# Altium schematic sheet Conn6&5.SchDoc
size A
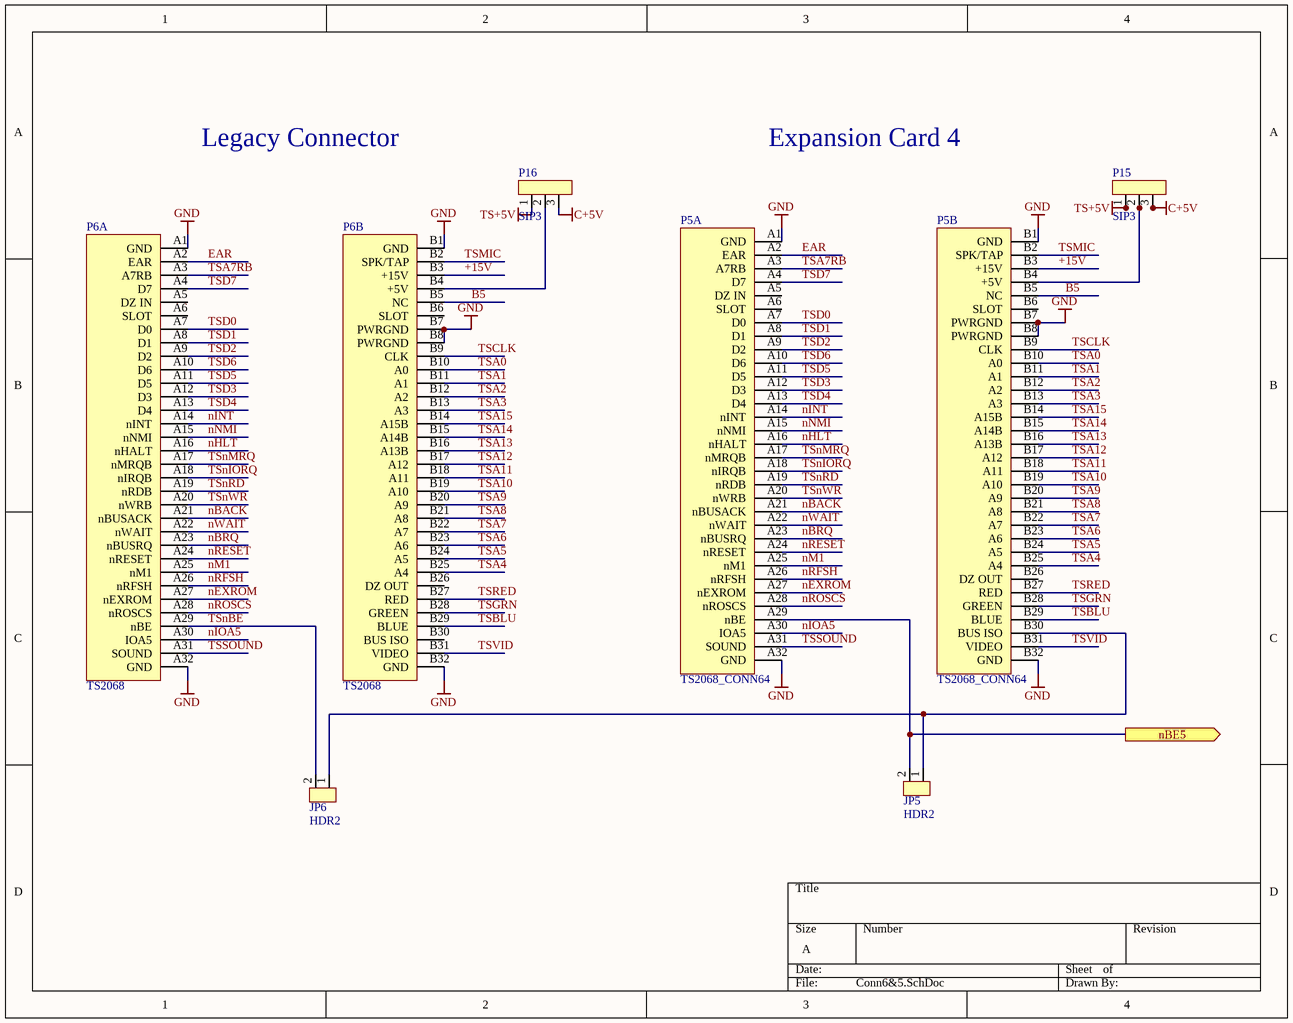
[diagram p0: Conn6&5.SchDoc]

## Parts
JP5  HDR2  [HDR2]
JP6  HDR2  [HDR2]
P5  TS2068_CONN64  [64CARDEDGE]  (parts A,B of 2)
P6  TS2068  [TS2068]  (parts A,B of 2)
P15  SIP3  [SIP3]
P16  SIP3  [SIP3]

## Ports
nBE5 (out)

## Nets
C+5V: P15.3 P16.3
GND: P5.A1(GND) P5.A32(GND) P5.B1(GND) P5.B7(PWRGND) P5.B8(PWRGND) P5.B32(GND) P6.A1(GND) P6.A32(GND) P6.B1(GND) P6.B7(PWRGND) P6.B8(PWRGND) P6.B32(GND)
TS+5V: P15.1 P16.1
+15V: P5.B3(+15V) P6.B3(+15V)
B5: P5.B5(NC) P6.B5(NC)
EAR: P5.A2(EAR) P6.A2(EAR)
nBACK: P5.A21(nBUSACK) P6.A21(nBUSACK)
nBE5: JP5.2 P5.A29(nBE) ; port nBE5
nBRQ: P5.A23(nBUSRQ) P6.A23(nBUSRQ)
nEXROM: P5.A27(nEXROM) P6.A27(nEXROM)
nHLT: P5.A16(nHALT) P6.A16(nHALT)
nINT: P5.A14(nINT) P6.A14(nINT)
nIOA5: P5.A30(IOA5) P6.A30(IOA5)
nM1: P5.A25(nM1) P6.A25(nM1)
nNMI: P5.A15(nNMI) P6.A15(nNMI)
nRESET: P5.A24(nRESET) P6.A24(nRESET)
nRFSH: P5.A26(nRFSH) P6.A26(nRFSH)
nROSCS: P5.A28(nROSCS) P6.A28(nROSCS)
nWAIT: P5.A22(nWAIT) P6.A22(nWAIT)
TSA0: P5.B10(A0) P6.B10(A0)
TSA1: P5.B11(A1) P6.B11(A1)
TSA2: P5.B12(A2) P6.B12(A2)
TSA3: P5.B13(A3) P6.B13(A3)
TSA4: P5.B25(A4) P6.B25(A4)
TSA5: P5.B24(A5) P6.B24(A5)
TSA6: P5.B23(A6) P6.B23(A6)
TSA7: P5.B22(A7) P6.B22(A7)
TSA7RB: P5.A3(A7RB) P6.A3(A7RB)
TSA8: P5.B21(A8) P6.B21(A8)
TSA9: P5.B20(A9) P6.B20(A9)
TSA10: P5.B19(A10) P6.B19(A10)
TSA11: P5.B18(A11) P6.B18(A11)
TSA12: P5.B17(A12) P6.B17(A12)
TSA13: P5.B16(A13B) P6.B16(A13B)
TSA14: P5.B15(A14B) P6.B15(A14B)
TSA15: P5.B14(A15B) P6.B14(A15B)
TSBLU: P5.B29(BLUE) P6.B29(BLUE)
TSCLK: P5.B9(CLK) P6.B9(CLK)
TSD0: P5.A7(D0) P6.A7(D0)
TSD1: P5.A8(D1) P6.A8(D1)
TSD2: P5.A9(D2) P6.A9(D2)
TSD3: P5.A12(D3) P6.A12(D3)
TSD4: P5.A13(D4) P6.A13(D4)
TSD5: P5.A11(D5) P6.A11(D5)
TSD6: P5.A10(D6) P6.A10(D6)
TSD7: P5.A4(D7) P6.A4(D7)
TSGRN: P5.B28(GREEN) P6.B28(GREEN)
TSMIC: P5.B2(SPK/TAP) P6.B2(SPK/TAP)
TSnBE: JP6.2 P6.A29(nBE)
TSnIORQ: P5.A18(nIRQB) P6.A18(nIRQB)
TSnMRQ: P5.A17(nMRQB) P6.A17(nMRQB)
TSnRD: P5.A19(nRDB) P6.A19(nRDB)
TSnWR: P5.A20(nWRB) P6.A20(nWRB)
TSRED: P5.B27(RED) P6.B27(RED)
TSSOUND: P5.A31(SOUND) P6.A31(SOUND)
TSVID: P5.B31(VIDEO) P6.B31(VIDEO)
NetJP5_1: JP5.1 JP6.1 P5.B30(BUS_ISO)
NetP5_B4: P5.B4(+5V) P15.2
NetP6_B4: P6.B4(+5V) P16.2

Not connected (* = marked no-connect by the designer): P5 A5(DZ_IN) A6(SLOT) B6(SLOT) B26(DZ_OUT); P6 A5(DZ_IN) A6(SLOT) B6(SLOT) B26(DZ_OUT) B30(BUS_ISO)

## Notes on the sheet
- Legacy Connector
- Expansion Card 4

## Library data of the parts
P5 = TS2068_CONN64: 64 Position Female Connector Non Specified - Dual Edge Gold 0.100" (2.54mm) Black; MFG: TD; MFG PN: 1761469-1; DK PN: 1761469-1-ND; FOOTPRINT: ESW-40; Populate: *
P6 = TS2068: Populate: *